# EAGLE design face_tracking_drone_ground (EAGLE 9.3.0)
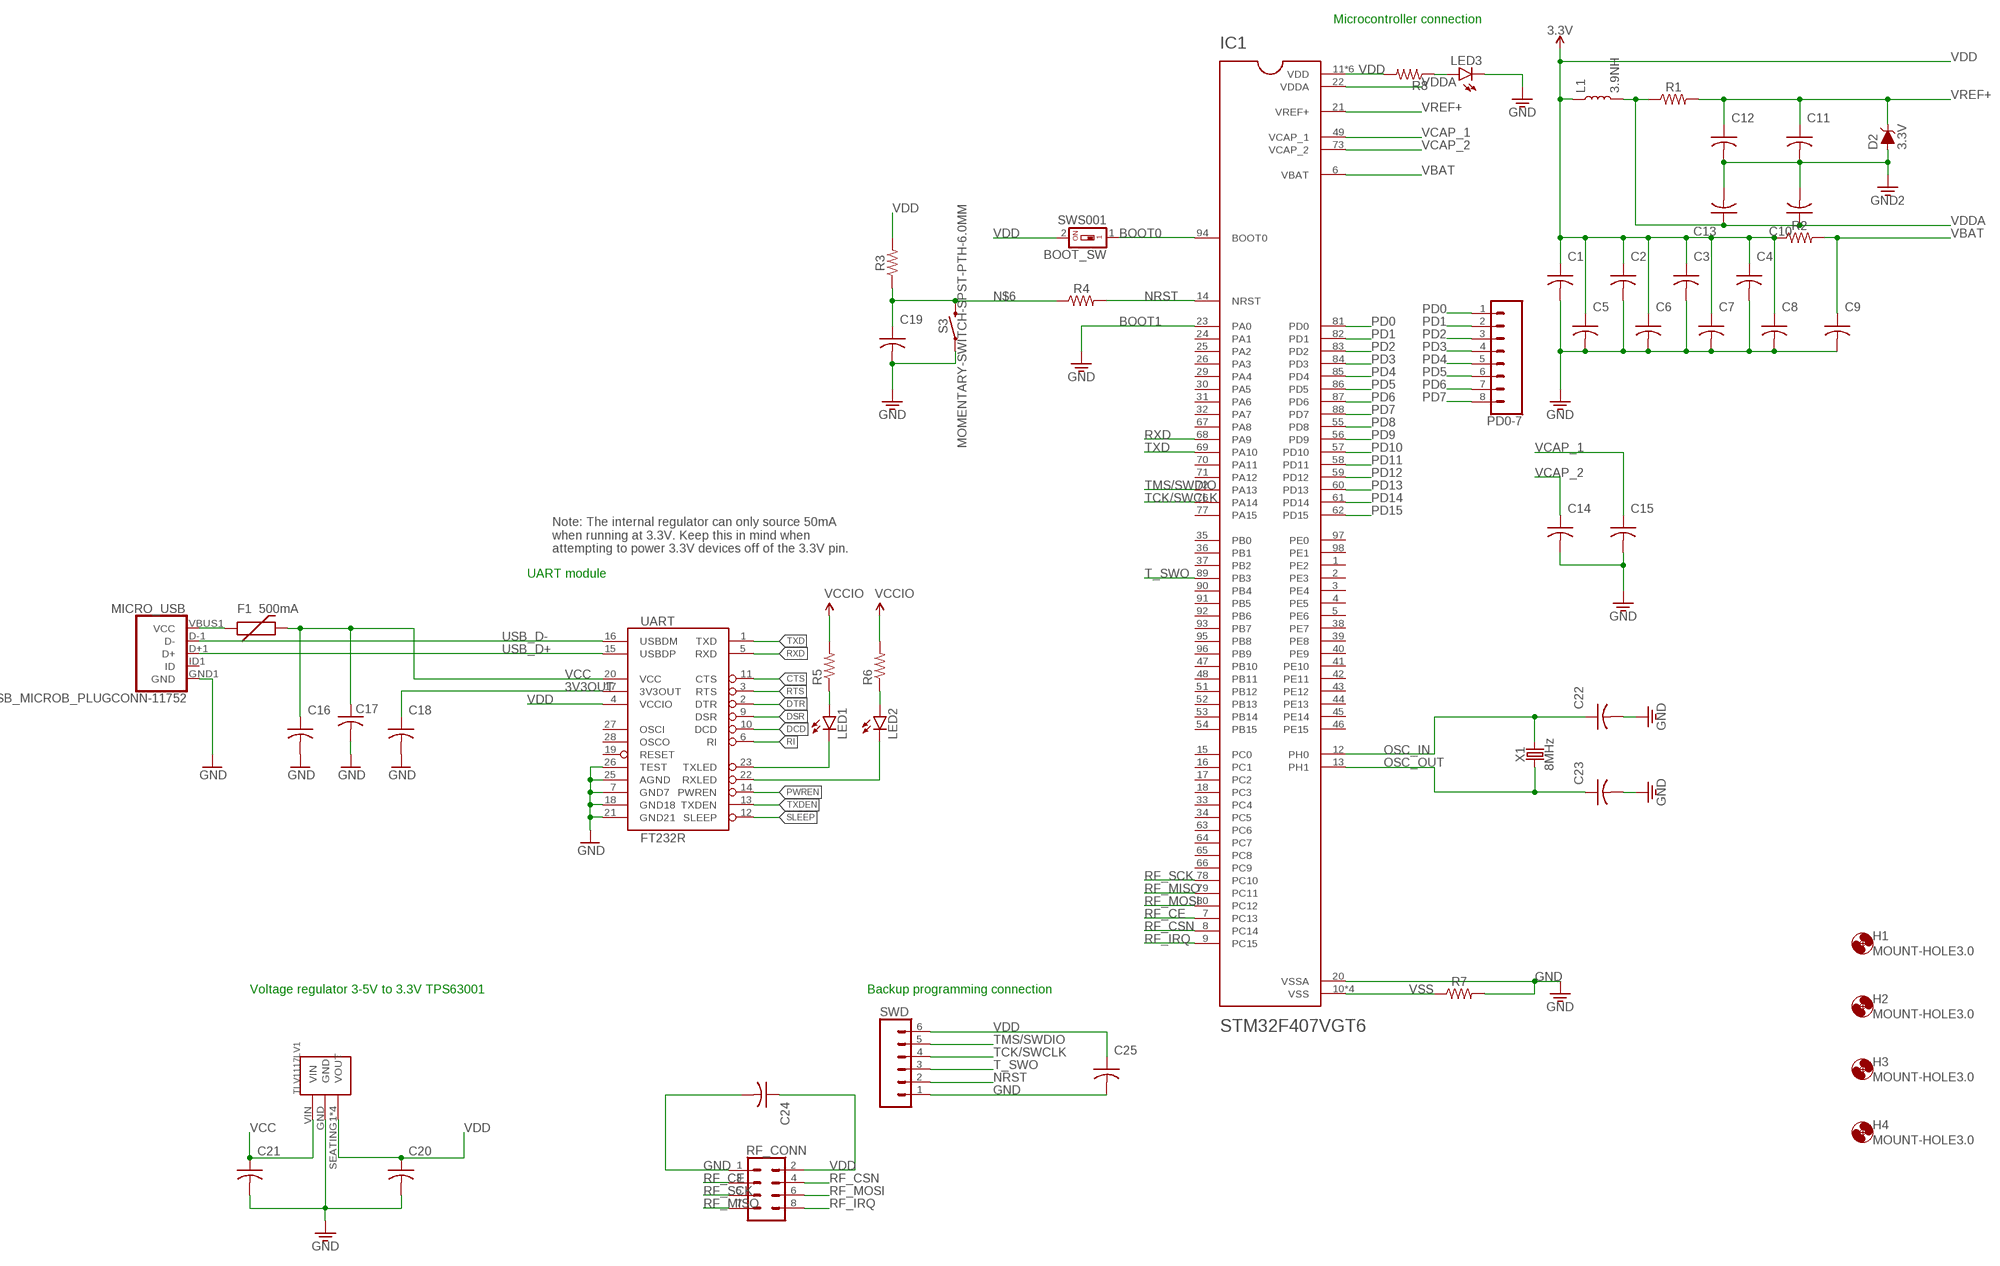
[diagram p0: schematic, sheet 1]

## Parts
BOOT_SW  SWS001  [SMS-001]
C1  0.1uF  C-USC0805  [C0805]
C2  0.1uF  C-USC0805  [C0805]
C3  0.1uF  C-USC0805  [C0805]
C4  0.1uF  C-USC0805  [C0805]
C5  0.1uF  C-USC0805  [C0805]
C6  0.1uF  C-USC0805  [C0805]
C7  0.1uF  C-USC0805  [C0805]
C8  0.1uF  C-USC0805  [C0805]
C9  0.1uF  C-USC0805  [C0805]
C10  0.1uF  C-USC0805  [C0805]
C11  0.1uF  C-USC0805  [C0805]
C12  1uF  C-USC0805  [C0805]
C13  1uF  C-USC0805  [C0805]
C14  2.2uF  C-USC0805  [C0805]
C15  2.2uF  C-USC0805  [C0805]
C16  0.1uF  C-USC0805  [C0805]
C17  10uF  C-USC0805  [C0805]
C18  0.1uF  C-USC0805  [C0805]
C19  2.2uF  C-USC0805  [C0805]
C20  0.1uF  C-USC0805  [C0805]
C21  0.1uF  C-USC0805  [C0805]
C22  20pF  C-USC0805  [C0805]
C23  20pF  C-USC0805  [C0805]
C24  0.1uF  C-USC0805  [C0805]
C25  0.1uF  C-USC0805  [C0805]
D2  3.3V  DIODE-ZENER-BZT52C3V6S  [SOD-323]
F1  500mA  PTCSMD  [PTC-1206]
H1  MOUNT-HOLE3.0  [3,0]
H2  MOUNT-HOLE3.0  [3,0]
H3  MOUNT-HOLE3.0  [3,0]
H4  MOUNT-HOLE3.0  [3,0]
IC1  STM32F407VGT6  [QFP50P1600X1600X160-100N]
L1  3.9NH  INDUCTOR-0402-3.9NH  [0402]
LED1  Red  LEDSML0805  [SML0805]
LED2  Green  LEDSML0805  [SML0805]
LED3  Green  LEDSML0805  [SML0805]
MICRO_USB  USB_MICROB_PLUGCONN-11752  [USB-B-MICRO-SMD_V03]
PD0-7  CONN_08"  [1X08]
R1  R-US_M0805  [M0805]
R2  R-US_M0805  [M0805]
R3  R-US_M0805  [M0805]
R4  R-US_M0805  [M0805]
R5  R-US_M0805  [M0805]
R6  R-US_M0805  [M0805]
R7  RESISTOR0805  [0805]
R8  R-US_M0805  [M0805]
RF_CONN  CONN_04X2  [2X4]
S3  MOMENTARY-SWITCH-SPST-PTH-6.0MM  [TACTILE_SWITCH_PTH_6.0MM]
SWD  CONN_06SILK_FEMALE_PTH  [1X06]
TLV1117LV1  TLV1117LV33DCYR  [TLV1117LV33DCYR]
UART  FT232R  FT232RLSSOP  [SSOP28DB]
X1  8MHz  CRYSTALPTH-HC49UV  [HC49U]

## Nets
3V3OUT [3.3power]: C18.1 UART.17(3V3OUT)
BOOT0: BOOT_SW.1 IC1.94(BOOT0)
BOOT1: IC1.23(PA0) ; supply symbol labelled GND
CTS: UART.11(CTS)
DCD: UART.10(DCD)
DSR: UART.9(DSR)
DTR: UART.2(DTR)
GND [3.3power]: C1.2 C2.2 C3.2 C4.2 C5.2 C6.2 C7.2 C8.2 C9.2 C10.2 C11.2 C12.2 C13.2 C14.2 C15.2 C16.2 C17.2 C18.2 C19.2 C20.2 C21.2 C22.2 C23.2 C24.2 C25.2 D2.A IC1.20(VSSA) LED3.C MICRO_USB.GND1(GND) R7.2 RF_CONN.1 S3.1 SWD.1 TLV1117LV1.GND UART.7(GND7) UART.18(GND18) UART.21(GND21) UART.25(AGND) UART.26(TEST) ; supply symbol labelled GND2
N$1: LED1.A R5.1
N$2: LED3.A R8.1
N$4: LED2.A R6.1
N$5: F1.1 MICRO_USB.VBUS1(VCC)
N$6: C19.1 R3.1 R4.1 S3.3
NRST: IC1.14(NRST) R4.2 SWD.2
OSC_IN: C22.1 IC1.12(PH0) X1.2
OSC_OUT: C23.1 IC1.13(PH1) X1.1
PD0: IC1.81(PD0) PD0-7.1
PD1: IC1.82(PD1) PD0-7.2
PD2: IC1.83(PD2) PD0-7.3
PD3: IC1.84(PD3) PD0-7.4
PD4: IC1.85(PD4) PD0-7.5
PD5: IC1.86(PD5) PD0-7.6
PD6: IC1.87(PD6) PD0-7.7
PD7: IC1.88(PD7) PD0-7.8
PD8: IC1.55(PD8)
PD9: IC1.56(PD9)
PD10: IC1.57(PD10)
PD11: IC1.58(PD11)
PD12: IC1.59(PD12)
PD13: IC1.60(PD13)
PD14: IC1.61(PD14)
PD15: IC1.62(PD15)
PWREN: UART.14(PWREN)
RF_CE: IC1.7(PC13) RF_CONN.3
RF_CSN: IC1.8(PC14) RF_CONN.4
RF_IRQ: IC1.9(PC15) RF_CONN.8
RF_MISO: IC1.79(PC11) RF_CONN.7
RF_MOSI: IC1.80(PC12) RF_CONN.6
RF_SCK: IC1.78(PC10) RF_CONN.5
RI: UART.6(RI)
RTS: UART.3(RTS)
RXD: IC1.68(PA9) UART.5(RXD)
RXLED: LED2.C UART.22(RXLED)
SLEEP: UART.12(SLEEP)
T_SWO: IC1.89(PB3) SWD.3
TCK/SWCLK: IC1.76(PA14) SWD.4
TMS/SWDIO: IC1.72(PA13) SWD.5
TXD: IC1.69(PA10) UART.1(TXD)
TXDEN: UART.13(TXDEN)
TXLED: LED1.C UART.23(TXLED)
USB_D+: MICRO_USB.D+1(D+) UART.15(USBDP)
USB_D-: MICRO_USB.D-1(D-) UART.16(USBDM)
VBAT: C9.1 IC1.6(VBAT) R2.2
VCAP_1: C15.1 IC1.49(VCAP_1)
VCAP_2: C14.1 IC1.73(VCAP_2)
VCC [3.3power]: C16.1 C17.1 C21.1 F1.2 TLV1117LV1.VIN UART.20(VCC)
VCCIO: R5.2 R6.2
VDD [3.3power]: BOOT_SW.2 C1.1 C2.1 C3.1 C4.1 C5.1 C6.1 C7.1 C8.1 C20.1 C24.1 C25.1 IC1.11(VDD) IC1.19(VDD) IC1.28(VDD) IC1.50(VDD) IC1.75(VDD) IC1.100(VDD) L1.1 R2.1 R3.2 R8.2 RF_CONN.2 SWD.6 TLV1117LV1.SEATING1(VOUT) TLV1117LV1.SEATING2(VOUT) TLV1117LV1.SEATING3(VOUT) TLV1117LV1.VOUT UART.4(VCCIO) ; supply symbol labelled 3.3V
VDDA: C10.1 C13.1 IC1.22(VDDA) L1.2 R1.1
VREF+: C11.1 C12.1 D2.C IC1.21(VREF+) R1.2
VSS: IC1.10(VSS) IC1.27(VSS) IC1.74(VSS) IC1.99(VSS) R7.1
Unconnected: IC1.1(PE2) IC1.2(PE3) IC1.3(PE4) IC1.4(PE5) IC1.5(PE6) IC1.15(PC0) IC1.16(PC1) IC1.17(PC2) IC1.18(PC3) IC1.24(PA1) IC1.25(PA2) IC1.26(PA3) IC1.29(PA4) IC1.30(PA5) IC1.31(PA6) IC1.32(PA7) IC1.33(PC4) IC1.34(PC5) IC1.35(PB0) IC1.36(PB1) IC1.37(PB2) IC1.38(PE7) IC1.39(PE8) IC1.40(PE9) IC1.41(PE10) IC1.42(PE11) IC1.43(PE12) IC1.44(PE13) IC1.45(PE14) IC1.46(PE15) IC1.47(PB10) IC1.48(PB11) IC1.51(PB12) IC1.52(PB13) IC1.53(PB14) IC1.54(PB15) IC1.63(PC6) IC1.64(PC7) IC1.65(PC8) IC1.66(PC9) IC1.67(PA8) IC1.70(PA11) IC1.71(PA12) IC1.77(PA15) IC1.90(PB4) IC1.91(PB5) IC1.92(PB6) IC1.93(PB7) IC1.95(PB8) IC1.96(PB9) IC1.97(PE0) IC1.98(PE1) MICRO_USB.ID1(ID) UART.19(RESET) UART.27(OSCI) UART.28(OSCO)

## Notes on the sheet
- Microcontroller connection
- Note: The internal regulator can only source 50mA
  when running at 3.3V. Keep this in mind when
  attempting to power 3.3V devices off of the 3.3V pin.
- UART module
- Voltage regulator 3-5V to 3.3V TPS63001 | Backup programming connection

## Library data of the parts
BOOT_SW = smd-special:SWS001: SMD Dip Switch 1 pol.
C1-C25 = BeagleBone_Black_Wireless:C-US: CAPACITOR, American symbol
D2 = SparkFun-DiscreteSemi:DIODE-ZENER: Zener Diode A Zener diode allows current to flow from its anode to its cathode like a normal semiconductor diode, but it also permits current to flow in the reverse direction when its "Zener voltage" is reached. - WIkipedia; PROD_ID: DIO-08199; VALUE: 3.6V
F1 = SparkFun:PTC: Resettable Fuse PTC Resettable Fuse. Spark Fun Electronics SKU : COM-08357
H1-H4 = holes:MOUNT-HOLE: MOUNTING HOLE with drill center marker
IC1 = STM32F407VGT6:STM32F407VGT6: STM32 Series 32-bit 1 MB Flash 192 kB RAM ARM Based Microcontroller - LQFP-100; AVAILABILITY: Unavailable; DESCRIPTION: STM32 Series 32-bit 1 MB Flash 192 kB RAM ARM Based Microcontroller - LQFP-100; MF: STMicroelectronics; MP: STM32F407VGT6; PACKAGE: LQFP-100 STMicroelectronics; PRICE: None
L1 = SparkFun-Coils:INDUCTOR: Inductors Resist changes in electrical current. Basically a coil of wire. SparkFun Products: SparkFun Load Cell Amplifier - HX711 <https://www.sparkfun.com/products/13879> IOIO-OTG - V2.2 <https://www.sparkfun.com/products/13613>; PROD_ID: NDUC-13457
LED1-LED3 = led:LED: LED OSRAM: - CHIPLED LG R971, LG N971, LY N971, LG Q971, LY Q971, LO R971, LY R971 LH N974, LH R974 LS Q976, LO Q976, LY Q976 LO Q996 - Hyper CHIPLED LW Q18S LB Q993, LB Q99A, LB R99A - SideLED LS A670, LO A670, LY A670, LG A670, LP A670 LB A673, LV A673, LT A673, LW A673 LH A674 LY A675 LS A676, LA A676, LO A676, LY A676, LW A676 LS A679, LY A679, LG A679 - Hyper Micro SIDELED® LS Y876, LA Y876, LO Y876, LY Y876 LT Y87S - SmartLED LW L88C, LW L88S LB L89C, LB L89S, LG L890 LS L89K, LO L89K, LY L89K LS L896, LA L896, LO L896, LY L896 - TOPLED LS T670, LO T670, LY T670, LG T670, LP T670 LSG T670, LSP T670, LSY T670, LOP T670, LYG T670 LG T671, LOG T671, LSG T671 LB T673, LV T673, LT T673, LW T673 LH T674 LS T676, LA T676, LO T676, LY T676, LB T676, LH T676, LSB T676, LW T676 LB T67C, LV T67C, LT T67C, LS T67K, LO T67K, LY T67K, LW E67C LS E67B, LA E67B, LO E67B, LY E67B, LB E67C, LV E67C, LT E67C LW T67C LS T679, LY T679, LG T679 LS T770, LO T770, LY T770, LG T770, LP T770 LB T773, LV T773, LT T773, LW T773 LH T774 LS E675, LA E675, LY E675, LS T675 LS T776, LA T776, LO T776, LY T776, LB T776 LHGB T686 LT T68C, LB T68C - Hyper Mini TOPLED® LB M676 - Mini TOPLED Santana® LG M470 LS M47K, LO M47K, LY M47K Source: http://www.osram.convergy.de LUXEON: - LUMILED® LXK2-PW12-R00, LXK2-PW12-S00, LXK2-PW14-U00, LXK2-PW14-V00 LXK2-PM12-R00, LXK2-PM12-S00, LXK2-PM14-U00 LXK2-PE12-Q00, LXK2-PE12-R00, LXK2-PE12-S00, LXK2-PE14-T00, LXK2-PE14-U00 LXK2-PB12-K00, LXK2-PB12-L00, LXK2-PB12-M00, LXK2-PB14-N00, LXK2-PB14-P00, LXK2-PB14-Q00 LXK2-PR12-L00, LXK2-PR12-M00, LXK2-PR14-Q00, LXK2-PR14-R00 LXK2-PD12-Q00, LXK2-PD12-R00, LXK2-PD12-S00 LXK2-PH12-R00, LXK2-PH12-S00 LXK2-PL12-P00, LXK2-PL12-Q00, LXK2-PL12-R00 Source: www.luxeon.com KINGBRIGHT: KA-3528ASYC Source: www.kingbright.com
MICRO_USB = SparkFun-Connectors:USB_MICROB_PLUG: USB Micro-B Plug Comes in a variety of packages. Check out Hirose's ZX-x0 line: http://www.hirose.co.jp/cataloge_hp/e24200011.pdf; PROD_ID: CONN-11752
PD0-7 = SparkFun-Connectors:CONN_08: Multi connection point. Often used as Generic Header-pin footprint for 0.1 inch spaced/style header connections On any of the 0.1 inch spaced packages, you can populate with these: Break Away Headers - Straight <https://www.sparkfun.com/products/116> (PRT-00116) Break Away Male Headers - Right Angle <https://www.sparkfun.com/products/553> (PRT-00553) Female Headers <https://www.sparkfun.com/products/115> (PRT-00115) Break Away Headers - Machine Pin <https://www.sparkfun.com/products/117> (PRT-00117) Break Away Female Headers - Swiss Machine Pin <https://www.sparkfun.com/products/743> (PRT-00743) Arduino Stackable Header - 8 Pin <https://www.sparkfun.com/products/9279> (PRT-09279) For SCREWTERMINALS and SPRING TERMINALS visit here: Screw Terimnals on SparkFun.com <https://www.sparkfun.com/search/results?term=Screw+Terminals> (5mm/3.5mm/2.54mm spacing) This device is also useful as a general connection point to wire up your design to another part of your project. Our various solder wires solder well into these plated through hole pads. Hook-Up Wire - Assortment (Stranded, 22 AWG) <https://www.sparkfun.com/products/11375> (PRT-11375) Hook-Up Wire - Assortment (Solid Core, 22 AWG) <https://www.sparkfun.com/products/11367> (PRT-11367) View the entire wire category on our website here <https://www.sparkfun.com/categories/141> Special notes: Molex polarized connector foot print use with SKU : PRT-08231 with associated crimp pins and housings. 1MM SMD Version SKU: PRT-10208 NOTES ON THE VARIANTS LOCK and LOCK_LONGPADS... This footprint was designed to help hold the alignment of a through-hole component (i.e. 6-pin header) while soldering it into place. You may notice that each hole has been shifted either up or down by 0.005 of an inch from it's more standard position (which is a perfectly straight line). This slight alteration caused the pins (the squares in the middle) to touch the edges of the holes. Because they are alternating, it causes a "brace" to hold the component in place. 0.005 has proven to be the perfect amount of "off-center" position when using our standard breakaway headers. Although looks a little odd when you look at the bare footprint, once you have a header in there, the alteration is very hard to notice. Also,if you push a header all the way into place, it is covered up entirely on the bottom side.; PROD_ID: CONN-08438
R1-R6 R8 = rcl:R-US_: RESISTOR, American symbol; SPICEPREFIX: R
R7 = SparkFun-Resistors:RESISTOR: Generic Resistor Package
RF_CONN = SparkFun-Connectors:CONN_04X2: Multi connection point. Often used as Generic Header-pin footprint for 0.1 inch spaced/style header connections On any of the 0.1 inch spaced packages, you can populate with these: Break Away Headers - Straight <https://www.sparkfun.com/products/116> (PRT-00116) Break Away Male Headers - Right Angle <https://www.sparkfun.com/products/553> (PRT-00553) Female Headers <https://www.sparkfun.com/products/115> (PRT-00115) Break Away Headers - Machine Pin <https://www.sparkfun.com/products/117> (PRT-00117) Break Away Female Headers - Swiss Machine Pin <https://www.sparkfun.com/products/743> (PRT-00743)
S3 = SparkFun-Switches:MOMENTARY-SWITCH-SPST: Momentary Switch (Pushbutton) - SPST Normally-open (NO) SPST momentary switches (buttons, pushbuttons). Variants PTH-12MM - 12mm square, through-hole Momentary Pushbutton Switch - 12mm Square <https://www.sparkfun.com/products/9190> (COM-09190) PTH-6.0MM, PTH-6.0MM-KIT - 6.0mm square, through-hole Mini Pushbutton Switch <https://www.sparkfun.com/products/97> (COM-00097) KIT package intended for soldering kit's - only one side of pads' copper is exposed. PTH-RIGHT-ANGLE-KIT - Right-angle, through-hole Right Angle Tactile Button <https://www.sparkfun.com/products/10791> - Used on SparkFun BigTime Watch Kit <https://www.sparkfun.com/products/11734> SMD-12MM - 12mm square, surface-mount Tactile Button - SMD (12mm) <https://www.sparkfun.com/products/12993> (COM-12993) Used on SparkFun PicoBoard <https://www.sparkfun.com/products/11888> SMD-4.5MM - 4.5mm Square Trackball Switch Used on SparkFun Blackberry Trackballer Breakout <https://www.sparkfun.com/products/13169> SMD-4.6MMX2.8MM - 4.60mm x 2.80mm, surface mount Used on SparkFun SAMD21 Mini Breakout <https://www.sparkfun.com/products/13664> SMD-5.2MM, SMD-5.2-REDUNDANT - 5.2mm square, surface-mount Mini Pushbutton Switch - SMD <https://www.sparkfun.com/products/8720> (COM-08720) Used on Arduino Pro Mini <https://www.sparkfun.com/products/11114> REDUNDANT package connects both switch circuits together SMD-6.0X3.5MM - 6.0 x 3.5mm, surface mount Momentary Reset Switch SMD <https://www.sparkfun.com/products/8229> (COM-08229) SMD-6.2MM-TALL - 6.2mm square, surface mount Tactile Button - SMD (6mm) <https://www.sparkfun.com/products/12992> Used on SparkFun Digital Sandbox <https://www.sparkfun.com/products/12651> SMD-RIGHT-ANGLE - Right-angle, surface mount Used on SparkFun Block for Intel® Edison - Arduino <https://www.sparkfun.com/products/13036>; PROD_ID: SWCH-08441; SF_SKU: COM-00097
SWD = SparkFun-Connectors:CONN_06: Multi connection point. Often used as Generic Header-pin footprint for 0.1 inch spaced/style header connections On any of the 0.1 inch spaced packages, you can populate with these: Break Away Headers - Straight <https://www.sparkfun.com/products/116> (PRT-00116) Break Away Male Headers - Right Angle <https://www.sparkfun.com/products/553> (PRT-00553) Female Headers <https://www.sparkfun.com/products/115> (PRT-00115) Break Away Headers - Machine Pin <https://www.sparkfun.com/products/117> (PRT-00117) Break Away Female Headers - Swiss Machine Pin <https://www.sparkfun.com/products/743> (PRT-00743) Arduino Stackable Header - 6 Pin <https://www.sparkfun.com/products/9280> (PRT-09280) For SCREWTERMINALS and SPRING TERMINALS visit here: Screw Terimnals on SparkFun.com <https://www.sparkfun.com/search/results?term=Screw+Terminals> (5mm/3.5mm/2.54mm spacing) This device is also useful as a general connection point to wire up your design to another part of your project. Our various solder wires solder well into these plated through hole pads. Hook-Up Wire - Assortment (Stranded, 22 AWG) <https://www.sparkfun.com/products/11375> (PRT-11375) Hook-Up Wire - Assortment (Solid Core, 22 AWG) <https://www.sparkfun.com/products/11367> (PRT-11367) View the entire wire category on our website here <https://www.sparkfun.com/categories/141>; PROD_ID: CONN-08437
TLV1117LV1 = OKI-78SR 12-3.3 Voltage regulator:TLV1117LV33DCYR
UART = SparkFun:FT232RL: USB UART FT232RL 4th Generation USB UART (USB <-> Serial) Controller. Spark Fun Electronics SKU : COM-00650
X1 = SparkFun-Clocks:CRYSTAL: Crystals (Generic) These are passive quartz crystals, which can be used as a clock source for a microcontroller. Crystal's are two-terminal devices. They require external "load" capacitors to generate an oscillating signal.

## Net classes
0 default: width 0.203 mm
1 3.3power: width 0.254 mm

## Board
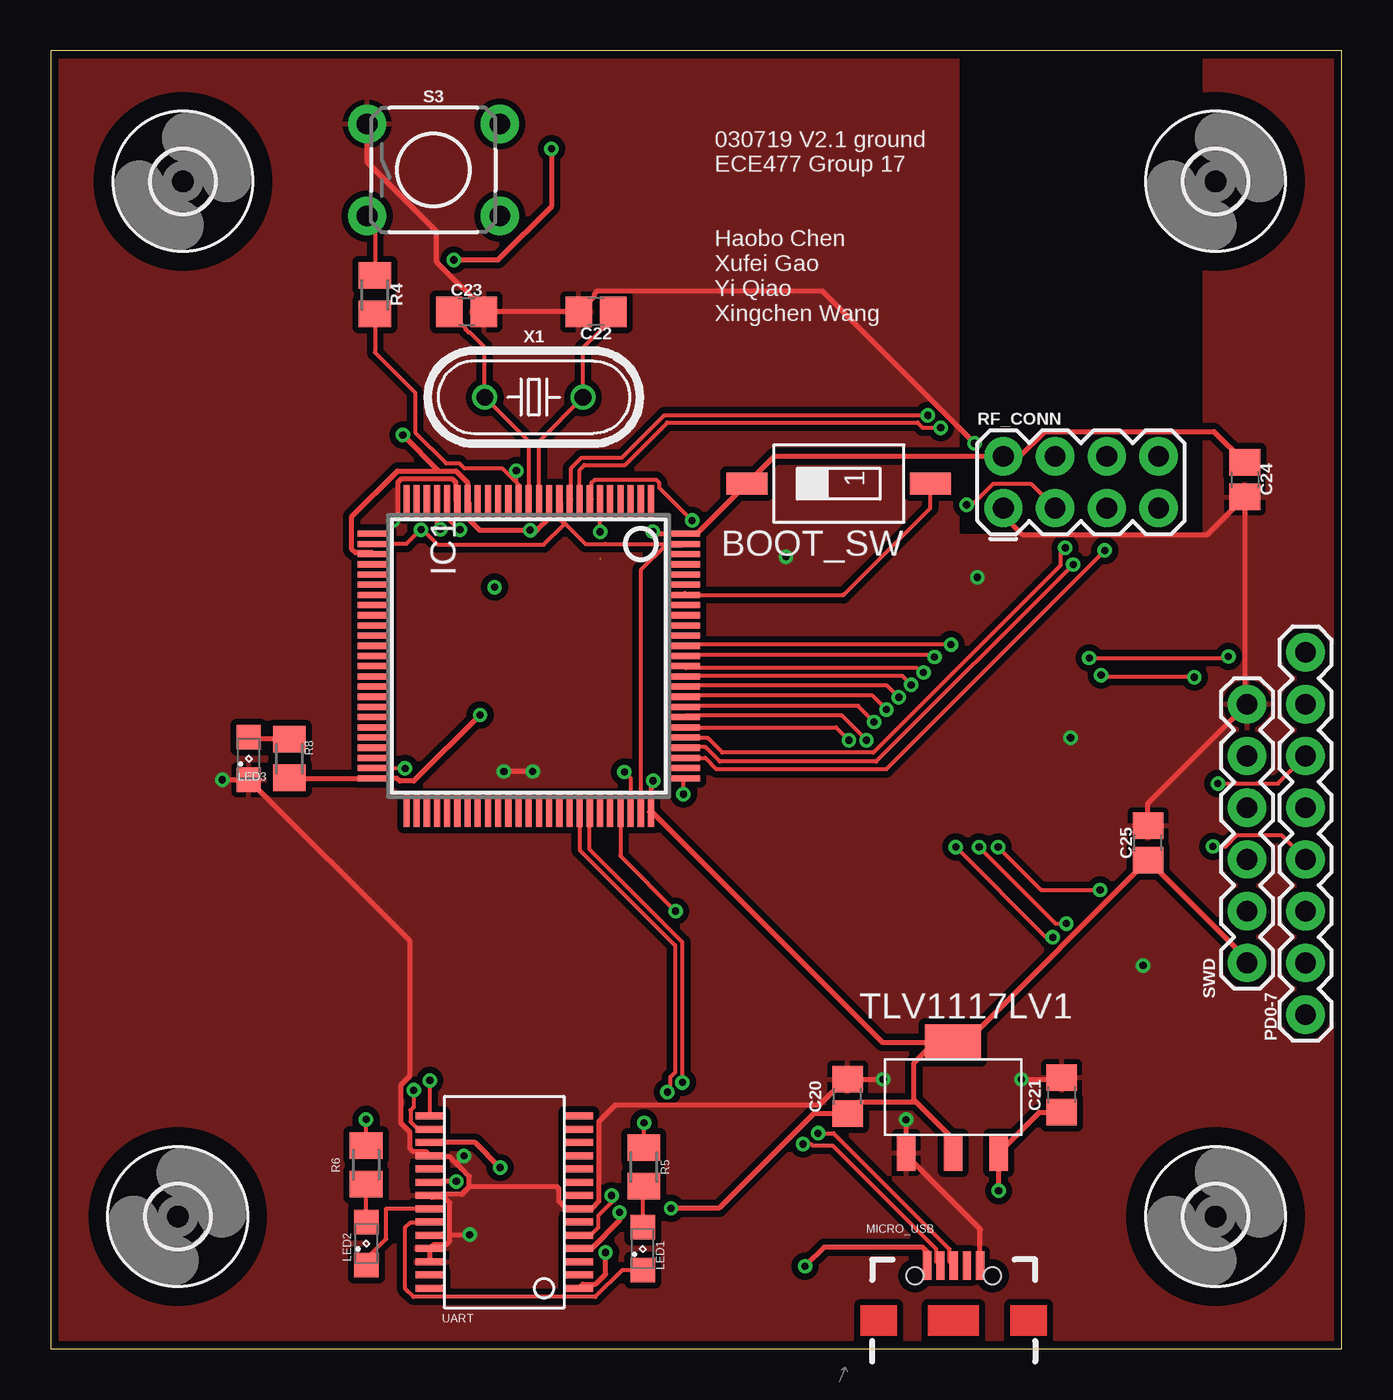
[diagram p1: board, top side]
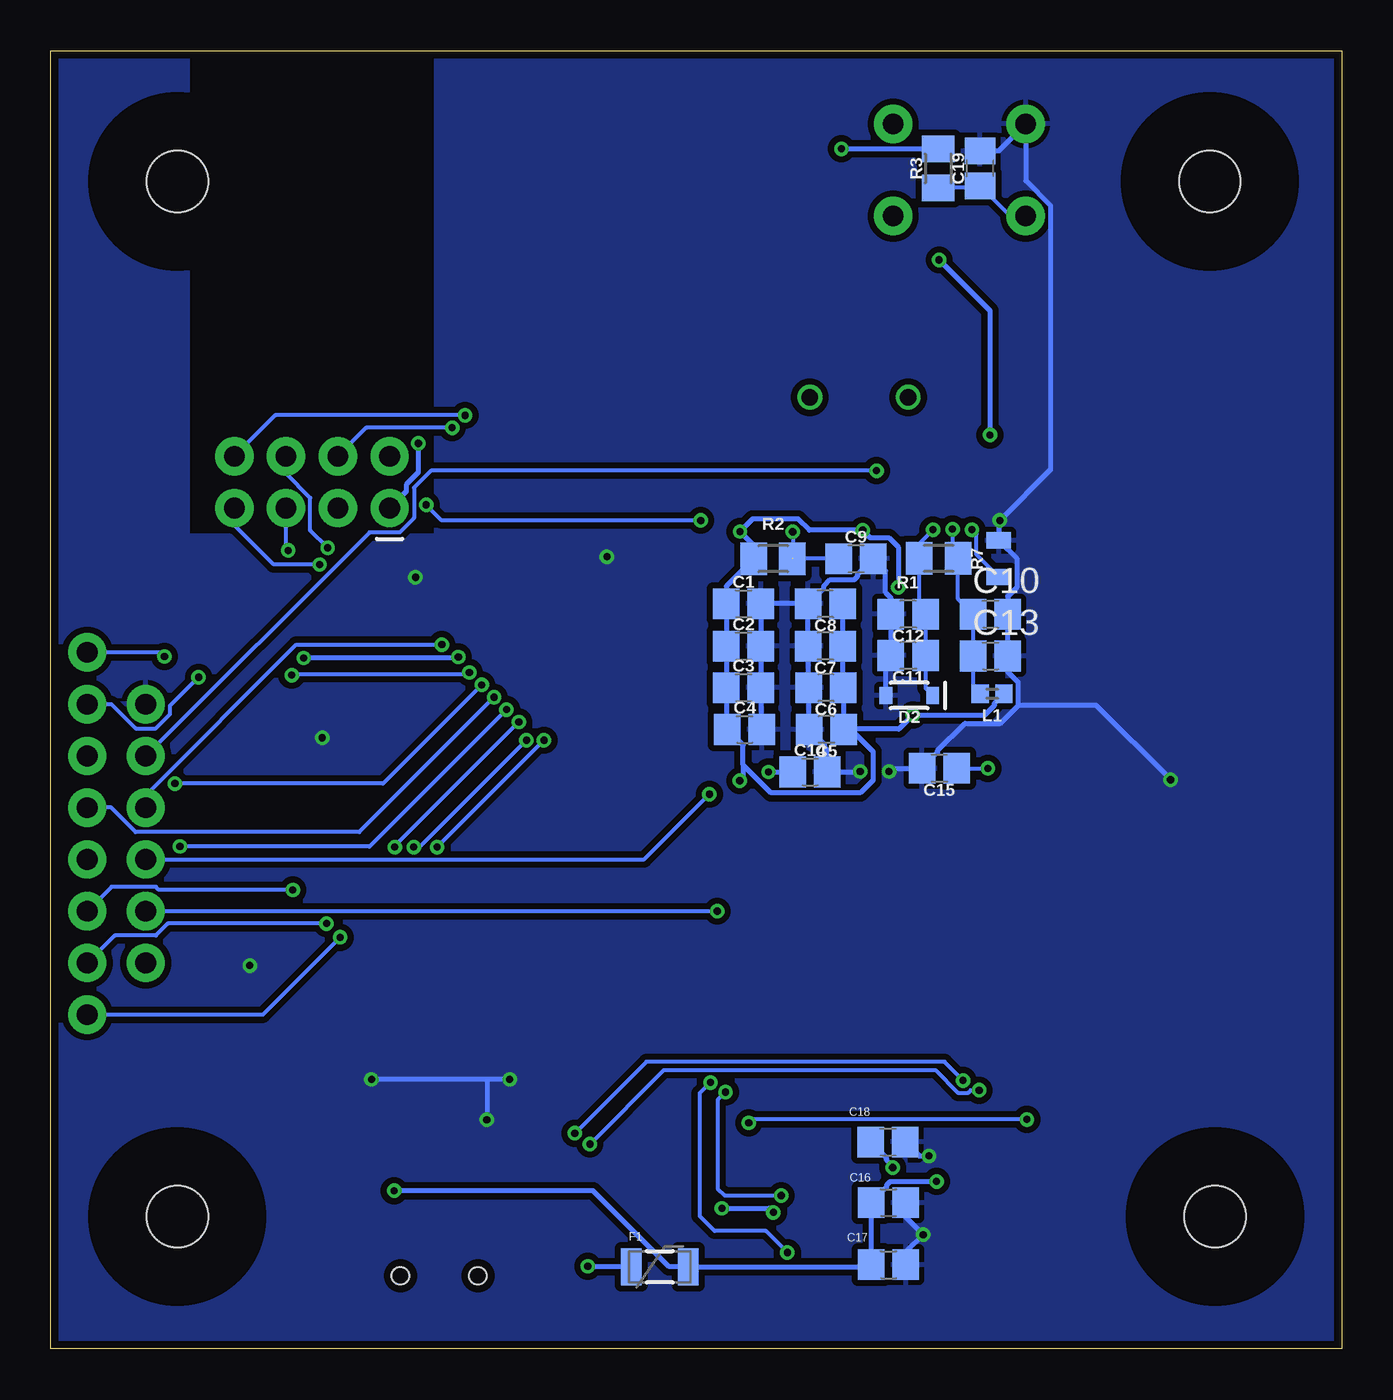
[diagram p2: board, bottom side, seen from below]

Size 63.35 x 63.68 mm. Coordinates in mm from the lower left corner, seen from the top.
Outline: 0,0 63.35,0 63.35,63.68 0,63.68 0,0
Copper layers (1*16): Top 0.0356mm / dielectric 1.5011mm / Bottom 0.0356mm
Design rules "ECE_Senior_Design *": minimum track width 6mil, minimum drill 13mil, track to track 6mil, track to pad 6mil, pad to pad 6mil, via to via 6mil, smd to smd 6mil, copper to edge 15mil, drill to drill 8mil, minimum pad ring 7mil, minimum via ring 7mil, stop-mask expansion 3mil, vias tented up to drill 0mil, thermal gap 10mil

### Footprints (pad centres in the part's own frame; a part is rotated, then mirrored left to right if it is on the bottom)
SMS-001 = smd 1.092 x 2.007: 1 0,-4.496; 2 0,4.496
C0805 = smd 1.3 x 1.5: 1 -0.85,0; 2 0.85,0
SOD-323 = smd 0.63 x 0.83: A 1.15,0; C -1.15,0
PTC-1206 = smd 1 x 1.8: 1 -1.4,0; 2 1.4,0
3,0 = hole 3: 0,0
QFP50P1600X1600X160-100N = smd 0.3 x 1.6: 1 -6,-7.6; 2 -5.5,-7.6; 3 -5,-7.6; 4 -4.5,-7.6; 5 -4,-7.6; 6 -3.5,-7.6; 7 -3,-7.6; 8 -2.5,-7.6; 9 -2,-7.6; 10 -1.5,-7.6; 11 -1,-7.6; 12 -0.5,-7.6; 13 0,-7.6; 14 0.5,-7.6; 15 1,-7.6; 16 1.5,-7.6; 17 2,-7.6; 18 2.5,-7.6; 19 3,-7.6; 20 3.5,-7.6; 21 4,-7.6; 22 4.5,-7.6; 23 5,-7.6; 24 5.5,-7.6; 25 6,-7.6; 51 6,7.6; 52 5.5,7.6; 53 5,7.6; 54 4.5,7.6; 55 4,7.6; 56 3.5,7.6; 57 3,7.6; 58 2.5,7.6; 59 2,7.6; 60 1.5,7.6; 61 1,7.6; 62 0.5,7.6; 63 0,7.6; 64 -0.5,7.6; 65 -1,7.6; 66 -1.5,7.6; 67 -2,7.6; 68 -2.5,7.6; 69 -3,7.6; 70 -3.5,7.6; 71 -4,7.6; 72 -4.5,7.6; 73 -5,7.6; 74 -5.5,7.6; 75 -6,7.6 | smd 1.6 x 0.3: 26 7.6,-6; 27 7.6,-5.5; 28 7.6,-5; 29 7.6,-4.5; 30 7.6,-4; 31 7.6,-3.5; 32 7.6,-3; 33 7.6,-2.5; 34 7.6,-2; 35 7.6,-1.5; 36 7.6,-1; 37 7.6,-0.5; 38 7.6,0; 39 7.6,0.5; 40 7.6,1; 41 7.6,1.5; 42 7.6,2; 43 7.6,2.5; 44 7.6,3; 45 7.6,3.5; 46 7.6,4; 47 7.6,4.5; 48 7.6,5; 49 7.6,5.5; 50 7.6,6; 76 -7.6,6; 77 -7.6,5.5; 78 -7.6,5; 79 -7.6,4.5; 80 -7.6,4; 81 -7.6,3.5; 82 -7.6,3; 83 -7.6,2.5; 84 -7.6,2; 85 -7.6,1.5; 86 -7.6,1; 87 -7.6,0.5; 88 -7.6,0; 89 -7.6,-0.5; 90 -7.6,-1; 91 -7.6,-1.5; 92 -7.6,-2; 93 -7.6,-2.5; 94 -7.6,-3; 95 -7.6,-3.5; 96 -7.6,-4; 97 -7.6,-4.5; 98 -7.6,-5; 99 -7.6,-5.5; 100 -7.6,-6
0402 = smd 0.85 x 0.9: 1 -0.58,0; 2 0.58,0
SML0805 = smd 1.2 x 1.2: A 1.05,0; C -1.05,0
USB-B-MICRO-SMD_V03 = smd 1.4 x 0.4: D+1 2.7,0; D-1 2.7,0.65; GND1 2.7,-1.3; ID1 2.7,-0.65; VBUS1 2.7,1.3 | hole 0.85: 2.2,1.9; 2.2,-1.9
1X08 = drill 1.016 pad 1.88: 1 0,0; 2 2.54,0; 3 5.08,0; 4 7.62,0; 5 10.16,0; 6 12.7,0; 7 15.24,0; 8 17.78,0
M0805 = smd 1.3 x 1.6: 1 -0.95,0; 2 0.95,0
0805 = smd 0.8 x 1.2: 1 -0.9,0; 2 0.9,0
2X4 = drill 1.016 pad 1.88: 1 -3.81,-1.27; 2 -3.81,1.27; 3 -1.27,-1.27; 4 -1.27,1.27; 5 1.27,-1.27; 6 1.27,1.27; 7 3.81,-1.27; 8 3.81,1.27
TACTILE_SWITCH_PTH_6.0MM = drill 1.016 pad 1.88: 1 -3.251,2.261; 2 3.251,2.261; 3 -3.251,-2.261; 4 3.251,-2.261
1X06 = drill 1.016 pad 1.88: 1 0,0; 2 2.54,0; 3 5.08,0; 4 7.62,0; 5 10.16,0; 6 12.7,0
TLV1117LV33DCYR = smd 0.914 x 1.778: GND 1.054,0.927; SEATING1 2.438,6.337; SEATING2 3.353,6.337; SEATING3 4.267,6.337; VIN 5.588,0.914; VOUT 3.353,0.914
SSOP28DB = smd 0.348 x 1.397: 1 -4.225,-3.656; 2 -3.575,-3.656; 3 -2.925,-3.656; 4 -2.275,-3.656; 5 -1.625,-3.656; 6 -0.975,-3.656; 7 -0.325,-3.656; 8 0.325,-3.656; 9 0.975,-3.656; 10 1.625,-3.656; 11 2.275,-3.656; 12 2.925,-3.656; 13 3.575,-3.656; 14 4.225,-3.656; 15 4.225,3.656; 16 3.575,3.656; 17 2.925,3.656; 18 2.275,3.656; 19 1.625,3.656; 20 0.975,3.656; 21 0.325,3.656; 22 -0.325,3.656; 23 -0.975,3.656; 24 -1.625,3.656; 25 -2.275,3.656; 26 -2.925,3.656; 27 -3.575,3.656; 28 -4.225,3.656
HC49U = drill 0.813: 1 -2.413,0; 2 2.413,0

### Placement (x,y rotation side)
BOOT_SW  38.66,42.44 90 top
C1  29.36,36.55 0 bottom
C2  29.36,34.47 0 bottom
C3  29.36,32.44 0 bottom
C4  29.31,30.38 0 bottom
C5  25.3,30.38 180 bottom
C6  25.32,32.44 180 bottom
C7  25.35,34.47 180 bottom
C8  25.35,36.55 180 bottom
C9  23.85,38.76 0 bottom
C10  17.25,36.04 0 bottom
C11  21.29,34.01 180 bottom
C12  21.29,36.04 180 bottom
C13  17.25,33.99 0 bottom
C14  26.11,28.3 0 bottom
C15  19.76,28.47 180 bottom
C16  22.25,7.16 0 bottom
C17  22.25,4.11 0 bottom
C18  22.28,10.13 0 bottom
C19  17.75,57.91 90 bottom
C20  39.09,12.37 90 top
C21  49.61,12.45 90 top
C22  26.75,50.88 180 top
C23  20.4,50.88 0 top
C24  58.59,42.65 270 top
C25  53.84,24.82 90 top
D2  21.23,32.05 180 bottom
F1  33.48,4.01 0 bottom
H1  57.15,6.48 0 top
H2  6.22,6.48 0 top
H3  6.48,57.28 0 top
H4  57.15,57.28 0 top
IC1  23.44,33.99 180 top
L1  17.17,32.13 180 bottom
LED1  29.03,4.9 90 top
LED2  15.47,5.16 90 top
LED3  9.7,28.96 90 top
MICRO_USB  44.3,1.37 90 top
PD0-7  61.57,16.38 90 top
R1  19.79,38.79 180 bottom
R2  27.91,38.76 0 bottom
R3  19.81,57.91 90 bottom
R4  15.9,51.71 270 top
R5  29.08,8.92 90 top
R6  15.47,9.02 90 top
R7  16.84,38.76 90 bottom
R8  11.71,28.96 270 top
RF_CONN  50.55,42.52 0 top
S3  18.77,57.84 0 top
SWD  58.7,31.62 270 top
TLV1117LV1  40.92,8.69 0 top
UART  22.25,7.19 90 top
X1  23.7,46.69 0 top

### Tracks (layer width: path | path; a pad name or v marks a point on that pad's centre or on a via)
3V3OUT  (via drill 0.35)
  Top 0.254: v22.05,8.88 20.81,10.11 UART.17
  Bottom 0.254: v22.05,8.88 22.05,9.06 22.1,9.11 22.19,9.11 22.36,9.27 22.36,9.36 C18.1
BOOT0
  Top 0.203: IC1.94 38.83,36.98 38.86,36.96 43.16,41.25 BOOT_SW.1
  Top 0.254: 31.11,37.06 IC1.94
GND  (via drill 0.35)
  Top 0.254: v40.84,13.21 v40.83,13.22 C20.2 38.99,13.22 37.72,11.95 27.7,11.95 26.88,11.14 26.88,7.22 26.52,6.86 UART.7 25.3,6.86 24.93,7.22 24.93,7.84 24.83,7.94 20.52,7.94 | v47.62,13.21 49.52,13.21 C21.2 | v41.96,11.23 41.96,9.63 TLV1117LV1.GND 41.97,9.49 45.62,5.84 45.6,5.82 MICRO_USB.GND1 | v23.64,28.32 v22.23,28.32 | v16.79,40.64 17.02,40.87 17.02,42.5 17.18,42.66 19.71,42.66 19.87,42.5 19.87,41.66 IC1.20 | C25.2 53.84,26.76 SWD.1 58.59,31.74 C24.2 56.72,39.93 47.7,39.93 46.74,40.89 RF_CONN.1 | UART.26 UART.25 18.79,5.11 19.41,5.11 19.57,5.27 19.57,5.59 | 19.57,5.59 19.57,7.15 19.33,7.4 19.33,7.42 18.69,7.42 UART.21 18.65,7.57 20.15,7.57 20.52,7.94 | 20.52,7.94 20.52,8.46 20.15,8.83 20.12,8.83 19.89,9.07 | 19.57,5.59 v20.55,5.59 | 19.89,9.07 v20.27,9.45 | C22.2 C23.2 21.25,51 18.93,53.32 18.93,54.81 15.52,58.22 S3.1 | 25.9,51.14 C22.2 | v8.41,27.91 v8.42,27.91 LED3.C 17.62,19.99 17.62,13.38 17.17,12.94 17.17,11.06 17.62,10.62 17.62,9.82 17.78,9.66 18.4,9.66 UART.18 18.63,9.42 19.53,9.42 19.89,9.07 | C22.2 26.67,51.65 26.67,51.74 26.83,51.91 37.84,51.91 v45.33,44.42
  Bottom 0.254: v40.84,13.21 41.96,13.21 | 41.96,13.21 v47.62,13.21 | 41.96,13.21 v41.96,11.23 | C4.2 28.51,30.43 C3.2 C2.2 C1.2 C8.2 | C8.2 C7.2 26.17,34.44 C6.2 26.15,32.41 C5.2 25.38,29.61 25.38,29.51 25.26,29.4 C14.2 23.67,28.3 v23.64,28.32 | C8.2 25.43,37.32 25.43,37.42 25.11,37.73 23.93,37.73 23.77,37.9 23.77,37.99 C9.2 22.4,38.16 22.4,37.1 22.14,36.84 C12.2 C11.2 22.38,33.76 D2.A | v22.23,28.32 22.07,28.47 C15.2 19.84,29.24 19.84,29.34 18.5,30.68 16.77,30.68 15.89,31.57 | C19.2 16.85,58.76 S3.1 15.52,57.3 14.3,56.08 14.3,43.13 v16.79,40.64 16.84,40.59 R7.2 15.96,38.78 15.96,37.34 16.4,36.91 C10.2 C13.2 16.4,33.21 15.89,32.7 15.89,31.57 | C17.2 21.4,4.74 v20.55,5.59 21.4,6.44 C16.2 | C18.2 20.74,9.45 v20.27,9.45 | v8.41,27.91 12.06,31.57 15.89,31.57 | v45.33,44.42 45.33,43 45.92,42.4 45.92,42.06 RF_CONN.1
  other vias: 53.59,18.8 50.04,29.97 45.47,37.85 36.07,38.86
  pour Top (isolate 0.305): 0,0 0,63.5 43.94,63.5 44.45,63.5 44.45,39.88 56.64,39.88 56.64,63.5 63.5,63.5 63.5,0
  pour Bottom (isolate 0.305): 0,0 0,63.5 44.45,63.5 44.45,39.88 56.64,39.88 56.64,63.5 63.5,63.5 63.5,0
N$1
  Top 0.203: R5.1 29.03,7.92 LED1.A
N$2
  Top 0.254: R8.1 9.8,29.91 LED3.A
N$4
  Top 0.203: LED2.A R6.1
N$5  (via drill 0.35)
  Top 0.254: MICRO_USB.VBUS1 43,4.75 42.77,4.98 37.95,4.98 v37.01,4.04
  Bottom 0.254: F1.1 36.98,4.01 v37.01,4.04
N$6
  Top 0.203: S3.3 15.9,55.19 R4.1
  Bottom 0.203: S3.3 16.27,55.58 C19.1 17.86,56.96 R3.1
NRST  (via drill 0.35)
  Top 0.203: IC1.14 22.98,41.62 22.98,42.36 22.85,42.49 | 22.85,42.49 22.13,43.2 20.28,43.2 20.04,43.45 19.39,43.45 17.88,44.96 17.88,46.91 15.9,48.88 R4.2 | 22.85,42.49 22.85,43.06 v22.84,43.08
  Bottom 0.203: v22.84,43.08 44.7,43.08 45.54,42.24 45.54,40.76 46.24,40.06 47.73,40.06 SWD.2
OSC_IN
  Top 0.203: IC1.12 23.94,44.52 X1.2 26.11,49.11 27.16,50.16 27.59,50.59 27.6,50.6 C22.1
OSC_OUT
  Top 0.203: C23.1 20.34,50.08 20.34,50.02 20.49,49.87 20.55,49.87 21.29,49.14 X1.1 23.44,44.53 IC1.13
PD0  (via drill 0.35)
  Top 0.203: IC1.81 38.53,30.48 v39.16,29.86 | v44.41,24.61 48.83,20.18 v49.16,20.18
  Bottom 0.203: v39.16,29.86 v44.41,24.61 | v49.16,20.18 52.96,16.38 PD0-7.1
PD1  (via drill 0.35)
  Top 0.203: IC1.82 31.12,31.06 38.81,31.06 v40.02,29.86 | v45.55,24.61 49.3,20.86 v49.83,20.86
  Bottom 0.203: v45.55,24.61 45.26,24.61 v40.02,29.86 | v49.83,20.86 57.62,20.86 58.2,20.27 60.22,20.27 PD0-7.2
PD2  (via drill 0.35)
  Top 0.203: IC1.83 31.09,31.54 39.61,31.54 v40.39,30.75 | v46.48,24.61 48.59,22.51 v51.48,22.51
  Bottom 0.203: v46.48,24.61 46.48,24.66 v40.39,30.75 | v51.48,22.51 58.05,22.51 58.2,22.66 60.38,22.66 PD0-7.3
PD3  (via drill 0.35)
  Top 0.203: IC1.84 31.09,32.04 40.32,32.04 v41,31.36 | v57.02,24.64 57.65,24.64 58.2,25.2 60.38,25.2 PD0-7.4
  Bottom 0.203: v41,31.36 47.72,24.64 v57.02,24.64
PD4  (via drill 0.35)
  Top 0.203: IC1.85 31.09,32.54 41.03,32.54 v41.61,31.96
  Bottom 0.203: PD0-7.5 60.39,26.54 59.19,25.35 48.22,25.35 v41.61,31.96
PD5  (via drill 0.35)
  Top 0.203: IC1.86 31.07,33.01 41.77,33.01 v42.21,32.57 | PD0-7.6 60.21,27.73 59.2,27.73 59.19,27.74 58.2,27.74 58.2,27.73 v57.27,27.73
  Bottom 0.203: v42.21,32.57 47.06,27.73 v57.27,27.73
PD6  (via drill 0.35)
  Top 0.203: v56.11,32.94 51.64,32.94 v51.54,33.05 | IC1.87 31.14,33.39 42.5,33.39 42.72,33.18 v42.82,33.18
  Bottom 0.203: PD0-7.7 60.39,31.62 59.19,30.43 58.2,30.43 57.51,31.13 57.51,31.55 v56.11,32.94 | v51.54,33.05 51.49,33.1 42.9,33.1 v42.82,33.18
PD7  (via drill 0.35)
  Top 0.203: IC1.88 31.09,34.04 43.26,34.04 v43.36,33.94 | v50.95,33.89 57.71,33.89 v57.78,33.96
  Bottom 0.203: 50.9,33.94 v50.95,33.89 | v57.78,33.96 57.99,34.16 PD0-7.8
  Bottom 0.254: v43.36,33.94 43.41,33.89 v50.95,33.89
RF_CE  (via drill 0.35)
  Top 0.203: IC1.7 26.54,41.68 26.54,42.49 26.69,42.64 29.7,42.64 29.85,42.49 29.85,42.26 v31.47,40.64 | v44.94,41.4 45.2,41.4 46.24,42.44 48.08,42.44 RF_CONN.3
  Bottom 0.203: v31.47,40.64 44.17,40.64 v44.94,41.4
RF_CSN  (via drill 0.35)
  Top 0.203: IC1.8 25.94,43.12 26.18,43.36 28.16,43.36 30.25,45.44 42.52,45.44 42.78,45.19 v43.66,45.19
  Bottom 0.203: v43.66,45.19 47.88,45.19 RF_CONN.4
RF_IRQ  (via drill 0.35)
  Top 0.203: IC1.9 25.53,41.67 25.53,43.2 26.04,43.71 28.02,43.71 30.1,45.8 v43.03,45.8
  Bottom 0.203: v43.03,45.8 52.35,45.8 RF_CONN.8
RF_MISO  (via drill 0.35)
  Top 0.203: IC1.79 31.07,29.51 32.11,29.51 32.82,28.8 40.49,28.8 v50.16,38.48
  Bottom 0.203: v50.16,38.48 52.42,38.48 54.3,40.36 54.3,41.2 RF_CONN.7
RF_MOSI  (via drill 0.35)
  Top 0.203: IC1.80 31.07,29.96 32.24,29.96 32.95,29.25 40.36,29.25 49.54,38.43 49.54,39.07 v49.77,39.3
  Bottom 0.203: v49.77,39.3 50.62,40.15 50.62,41.74 51.82,42.94 RF_CONN.6
RF_SCK  (via drill 0.35)
  Top 0.203: v51.71,39.17 40.97,28.43 32.67,28.43 32.11,28.98 IC1.78
  Bottom 0.203: v51.71,39.17 51.82,39.27 RF_CONN.5
RXD  (via drill 0.35)
  Top 0.203: IC1.68 25.94,24.48 30.63,19.79 30.63,13.56 30.38,13.31 30.38,12.71 v30.25,12.58 | v27.52,7.51 27.52,7.17 26.86,6.52 26.86,5.93 26.51,5.58 25.93,5.58 UART.5
  Bottom 0.203: v30.25,12.58 30.63,12.2 30.63,7.85 30.29,7.51 v27.52,7.51
RXLED
  Top 0.203: LED2.C 15.47,4.4 16.45,5.38 16.45,6.87 UART.22
T_SWO  (via drill 0.35)
  Top 0.203: v44.17,34.54 31.1,34.54 IC1.89
  Bottom 0.203: SWD.3 58.7,27.15 51.31,34.54 v44.17,34.54
TCK/SWCLK  (via drill 0.35)
  Top 0.203: v31.04,27.2 v31.04,27.21 IC1.76
  Bottom 0.203: SWD.4 34.24,24 v31.04,27.2
TMS/SWDIO  (via drill 0.35)
  Top 0.203: IC1.72 27.94,24.18 v30.66,21.46
  Bottom 0.203: v30.66,21.46 SWD.5
TXD  (via drill 0.35)
  Top 0.203: v30.99,13.06 30.99,19.94 26.44,24.49 IC1.69
  Top 0.254: UART.1 26.1,3.16 26.72,3.16 27.22,3.66 v27.22,4.71
  Bottom 0.203: v27.22,4.71 28.27,5.77 30.78,5.77 31.52,6.5 31.52,12.53 v30.99,13.06
TXLED
  Top 0.203: UART.23 18.58,6.19 17.64,6.19 17.39,5.94 17.39,2.94 17.79,2.54 26.71,2.54 28.03,3.85 LED1.C
USB_D+  (via drill 0.35)
  Top 0.203: MICRO_USB.D+1 44.1,4.27 44.1,4.88 38.41,10.57 v37.64,10.57 | v18.59,13.16 UART.15
  Bottom 0.203: v37.64,10.57 34.14,14.07 19.51,14.07 v18.59,13.16
USB_D-  (via drill 0.35)
  Top 0.203: MICRO_USB.D-1 43.45,4.27 43.45,4.88 38.37,9.96 37.39,9.96 37.32,10.03 v36.91,10.03 | UART.16 18.58,10.78 17.99,10.78 17.64,11.13 17.64,11.69 17.8,11.86 v17.8,12.68
  Bottom 0.203: v36.91,10.03 33.27,13.66 19.96,13.66 18.84,12.55 18.34,12.55 18.22,12.68 v17.8,12.68
VBAT  (via drill 0.35)  (1 unrouted)
  Top 0.203: v26.95,40.08 IC1.6
  Bottom 0.203: v26.95,40.08 R2.2 C9.1 | 26.95,38.78 R2.2
VCAP_1  (via drill 0.35)
  Top 0.203: IC1.49 15.86,28.46 v17.37,28.46 v17.37,28.47
  Bottom 0.203: C15.1 v17.37,28.47
VCAP_2  (via drill 0.35)
  Top 0.203: v28.14,28.3 28.45,27.99 IC1.73
  Bottom 0.254: v28.14,28.3 C14.1
VCC  (via drill 0.35)
  Top 0.254: v19.89,8.2 18.63,8.2 UART.20 | v46.51,7.75 TLV1117LV1.VIN 48.5,11.6 C21.1
  Bottom 0.254: v19.89,8.2 22.16,8.2 22.33,8.03 22.33,7.93 C16.1 C17.1 23.2,4.01 F1.2 33.02,4.01 36.75,7.75 v46.51,7.75
VCCIO  (via drill 0.35)
  Top 0.203: R6.2 v15.47,11.24 v15.46,11.24 | v29.11,11.07 29.08,11.05 R5.2
  Bottom 0.203: v15.46,11.24 28.94,11.24 v29.11,11.07
VDD  (via drill 0.35)
  Top 0.254: 42.35,12.21 44.27,10.29 TLV1117LV1.VOUT | 42.35,12.21 42.35,12.1 39.67,12.1 C20.1 37.41,11.52 32.78,6.88 v30.43,6.88 | 42.35,12.21 42.35,14.02 TLV1117LV1.SEATING1 | v21.06,31.09 17.81,27.84 17.11,27.84 16.97,27.98 IC1.50 11.73,27.98 R8.2 | v29.55,27.86 29.44,27.76 IC1.75 | v29.54,40.09 29.65,39.98 IC1.100 31.7,39.98 BOOT_SW.2 35.51,43.79 RF_CONN.2 47.55,43.79 48.77,45.01 57.07,45.01 C24.1 | IC1.11 24.44,40.74 23.86,40.16 v23.52,40.16 21.03,40.16 20.52,40.67 20.52,41.52 IC1.19 20.44,42.51 19.88,43.07 19.03,43.07 | IC1.75 29.37,26.32 | TLV1117LV1.SEATING1 TLV1117LV1.SEATING2 TLV1117LV1.SEATING3 45.19,15.32 C25.1 58.7,19.1 SWD.6 | v24.56,58.88 24.56,56.04 21.95,53.42 v19.77,53.42 | v17.27,44.83 19.03,43.07 | UART.4 26.52,4.91 27.9,6.29 v27.9,6.68 | IC1.75 40.8,15.02 TLV1117LV1.SEATING1 | 19.03,43.07 17.01,43.07 14.77,40.83 14.77,39.22 14.93,39.06 15.77,39.06 IC1.28
  Bottom 0.254: C8.1 C7.1 24.5,32.46 C6.1 24.47,30.4 | 24.47,30.4 C5.1 24.1,30.38 23.01,29.29 23.01,27.89 23.63,27.27 28.01,27.27 29.39,28.65 | 24.47,30.4 21.74,30.4 v21.06,31.09 17.52,31.09 17.05,31.57 17.05,31.68 L1.1 | 29.39,28.65 29.39,29.61 C4.1 30.21,30.43 C3.1 C2.1 C1.1 30.21,37.41 R2.1 28.86,39.42 v29.54,40.09 28.92,40.71 26.69,40.71 26.13,40.16 v23.52,40.16 23.15,39.79 22.23,39.79 21.77,39.32 v21.77,37.36 | 29.39,28.65 29.39,28.02 v29.55,27.86 | v24.56,58.88 19.83,58.88 R3.2 | v19.77,53.42 17.27,50.93 v17.27,44.83 | v30.43,6.88 28.11,6.88 v27.9,6.68
VDDA  (via drill 0.35)
  Top 0.203: v19.11,40.21 18.94,40.37 IC1.22
  Bottom 0.203: v19.11,40.21 19.11,38.93 18.96,38.79 R1.1 18.84,36.78 C10.1 C13.1 18.1,32.48 L1.2
VREF+  (via drill 0.35)
  Top 0.203: v20.07,40.18 20.01,40.18 19.44,40.75 IC1.21
  Bottom 0.203: v20.07,40.18 20.07,40.17 20.86,39.37 20.86,38.91 R1.2 20.74,36.34 C12.1 C11.1 20.43,32.41 D2.C
VSS  (via drill 0.35)
  Top 0.203: IC1.27 17.44,39.48 18.14,40.18 v18.16,40.18 18.25,40.18 18.98,39.45 24.18,39.45 25.2,40.46 24.94,40.72 IC1.10 25.04,41.49 25.04,40.68 26.25,39.47 27.2,39.47 27.21,39.48 IC1.99 30.95,39.39 30.14,39.39 28.94,38.19 IC1.74
  Bottom 0.203: R7.1 17.93,38.95 17.93,39.97 18.14,40.18 v18.16,40.18

### Text on the board
tPlace: 030719 V2.1 ground / ECE477 Group 17 / / / Haobo Chen / Xufei Gao / Yi Qiao / Xingchen Wang